# Altium schematic sheet Intercomm_sheet_1.SchDoc
size 594 x 420 mm; SheetNumber: 1; SheetTotal: 2
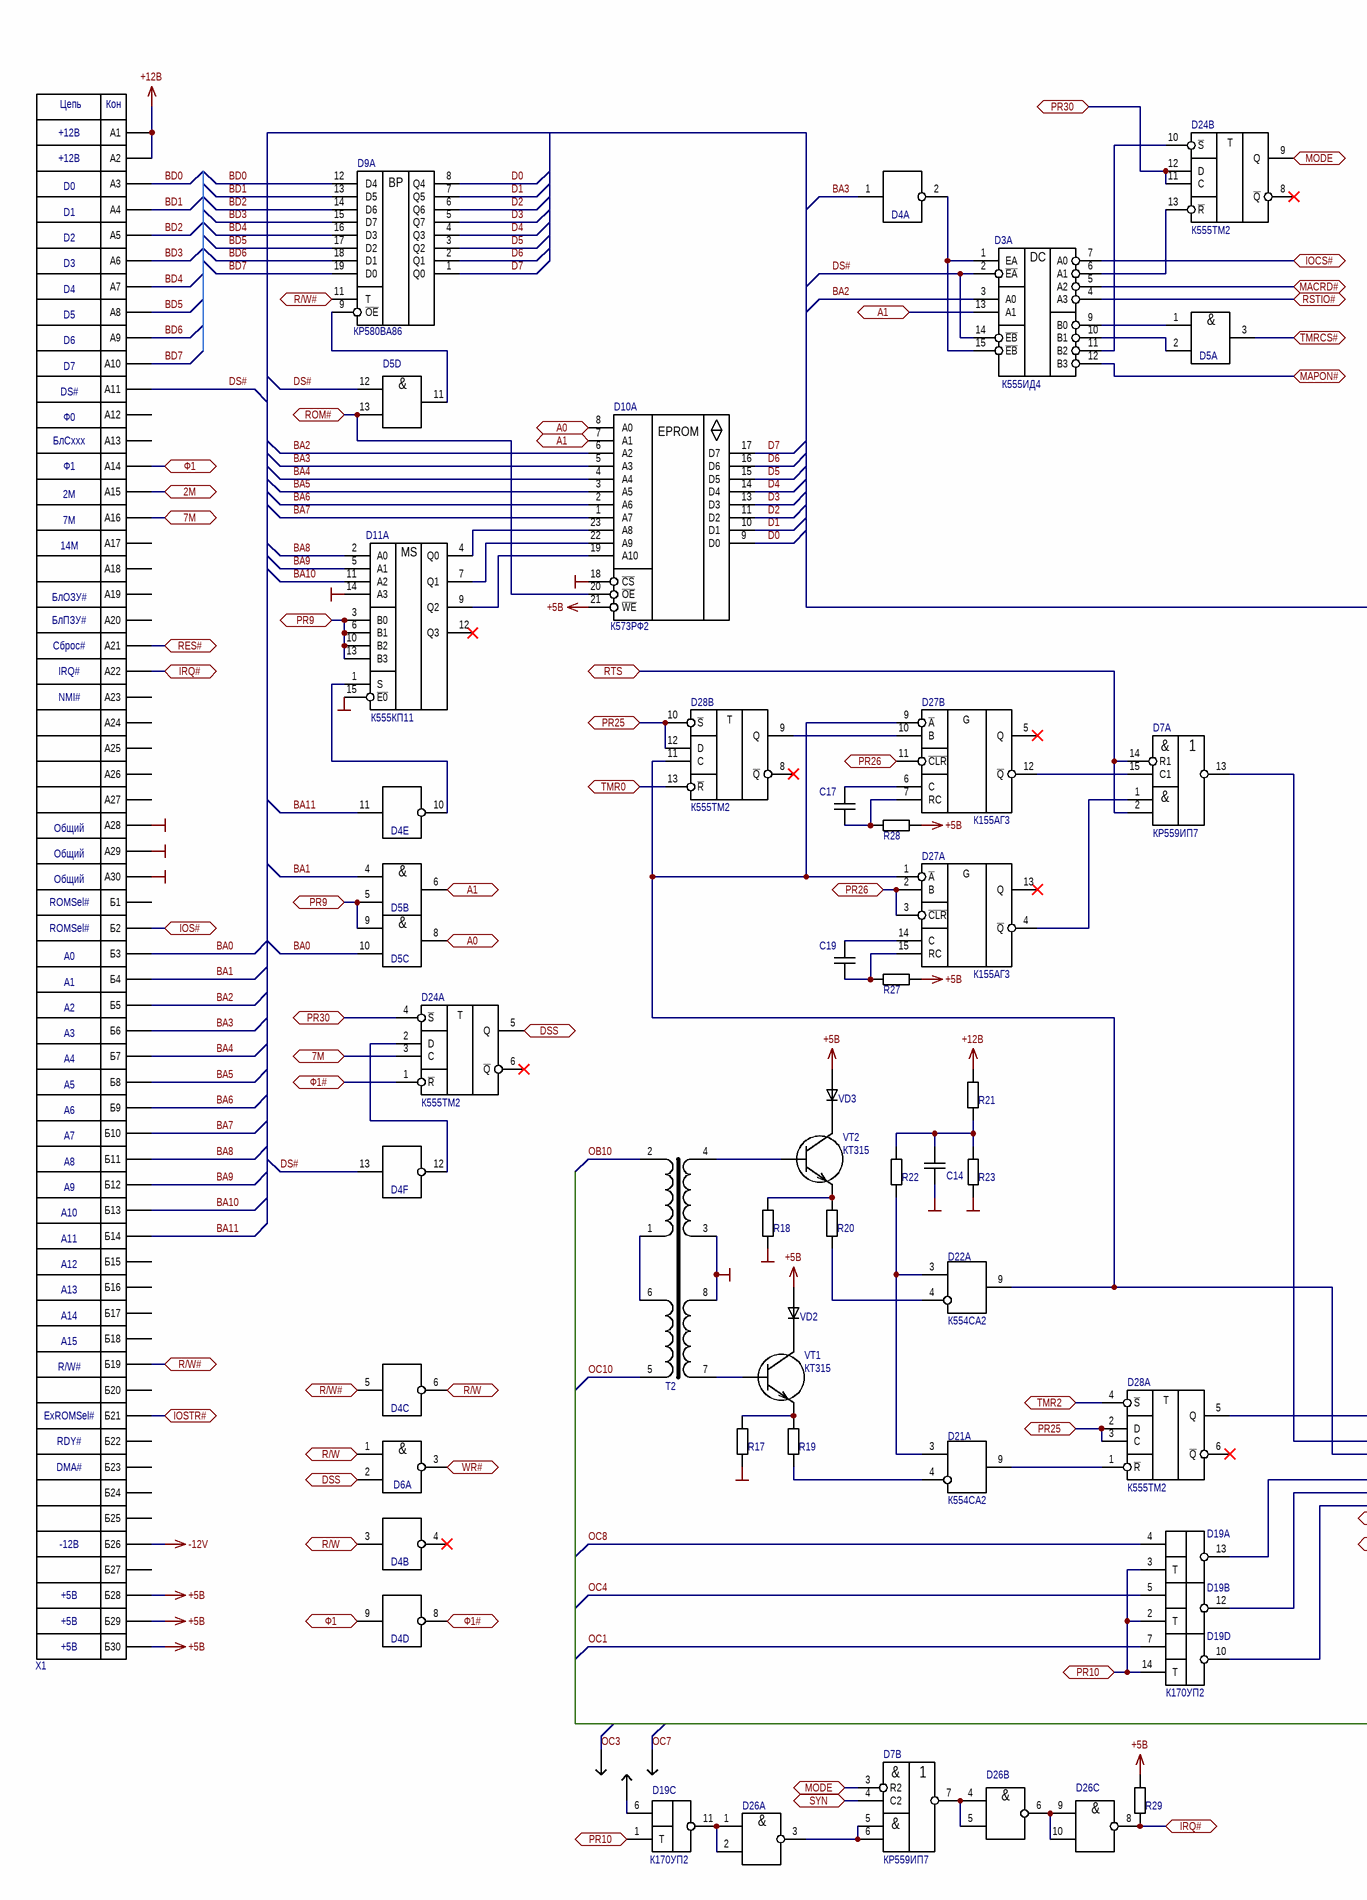
[diagram p0: Intercomm_sheet_1.SchDoc, left]
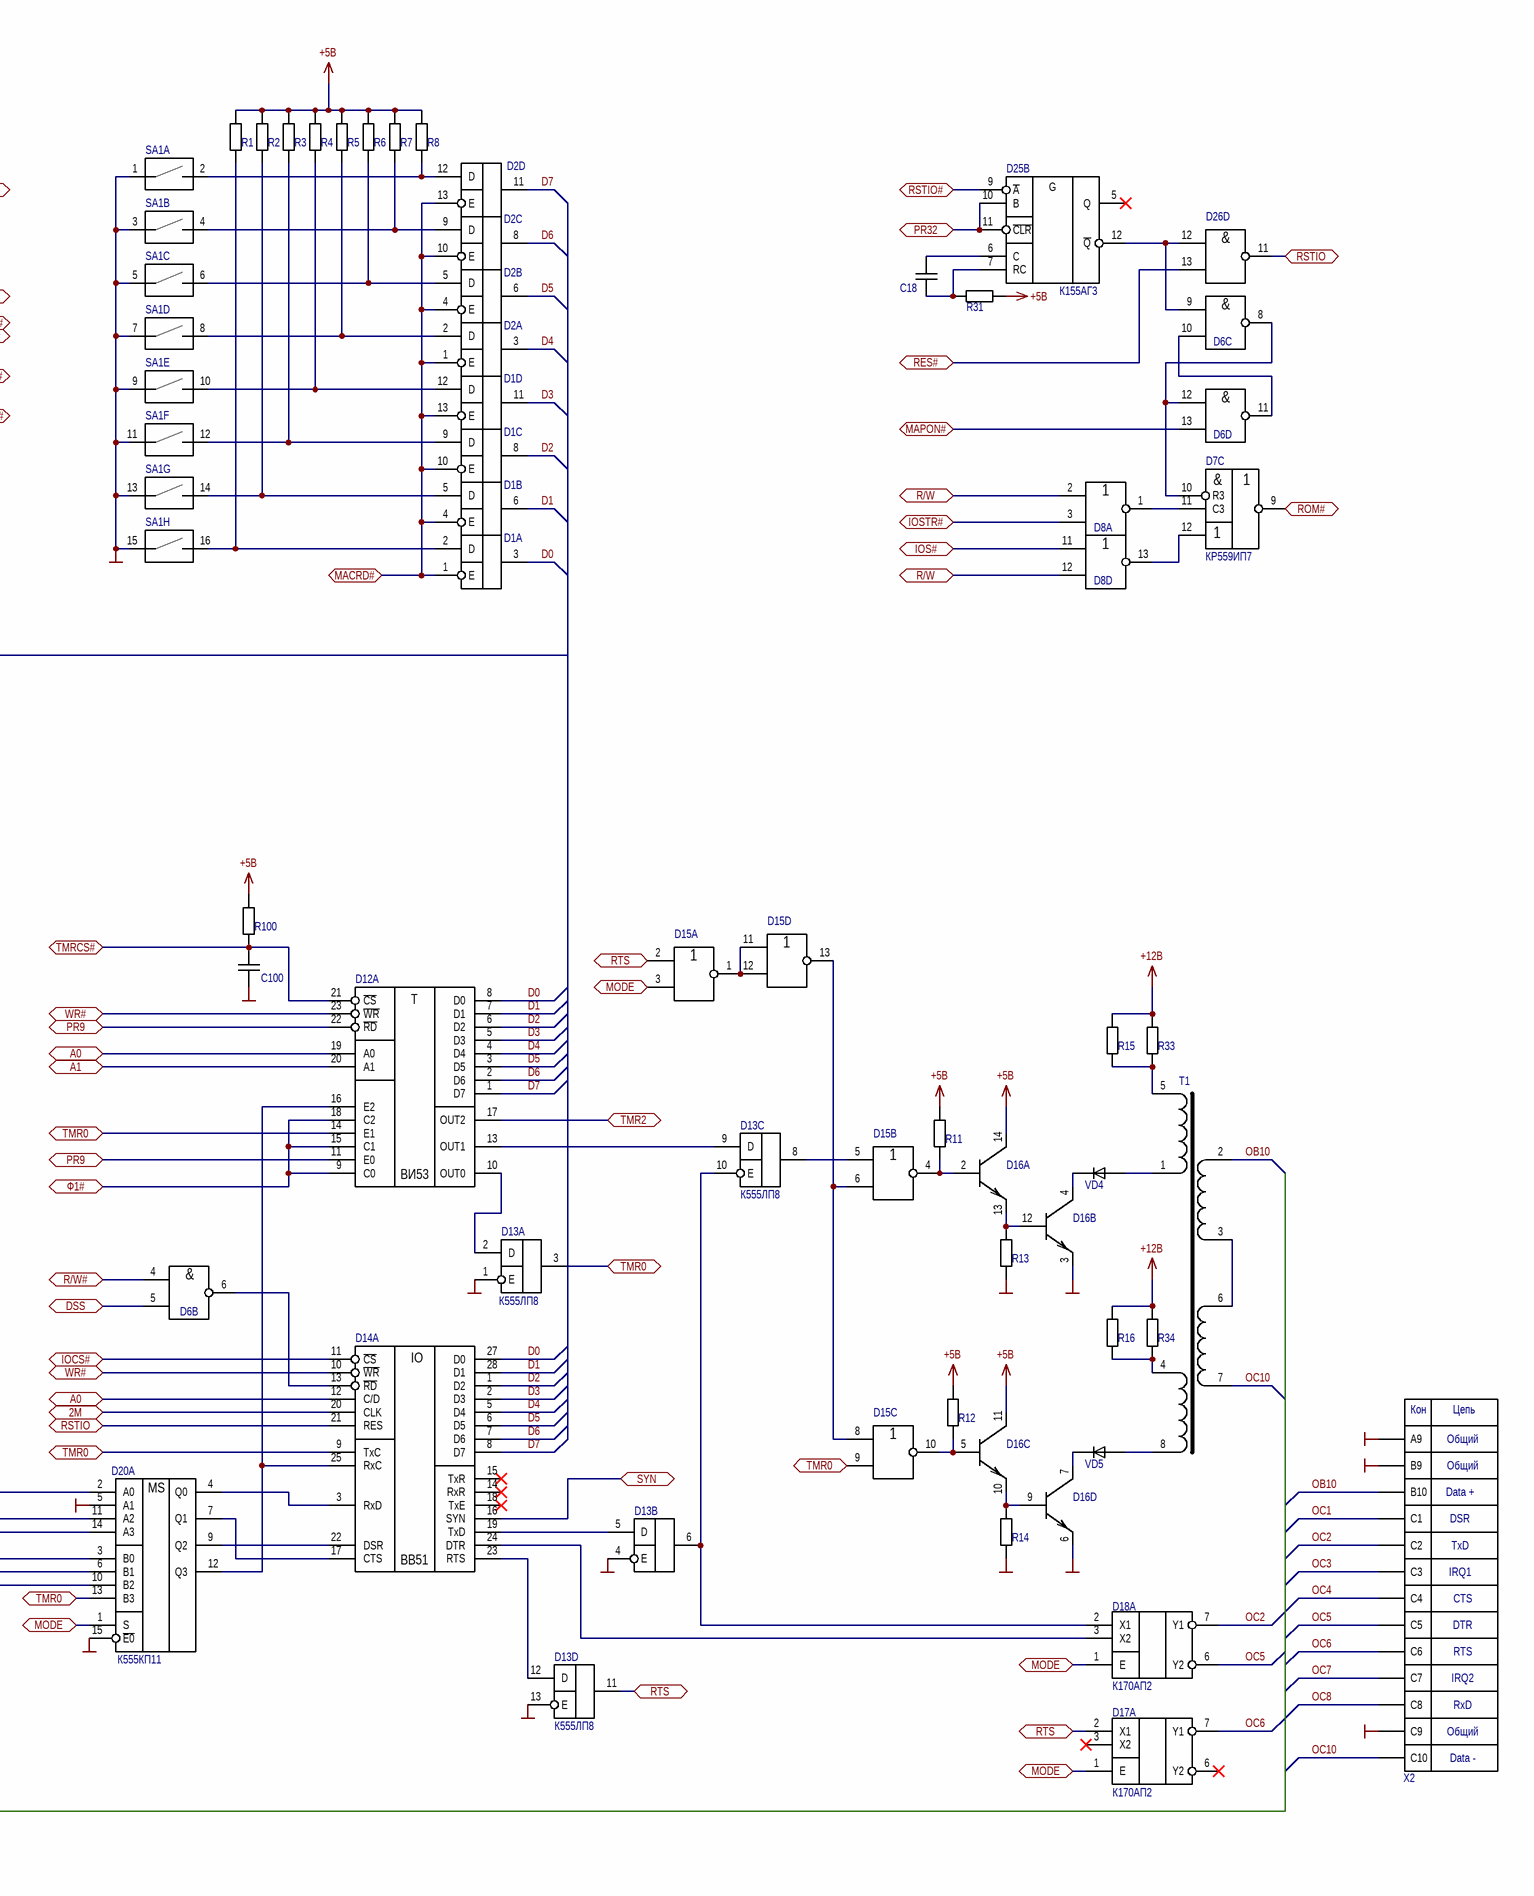
[diagram p1: Intercomm_sheet_1.SchDoc, right]

## Parts
C14  0,1  [C5]  (value not drawn)
C17  0,1  [C5]  (value not drawn)
C18  0,1  [C5]  (value not drawn)
C19  0,1  [C5]  (value not drawn)
C100  0,1  [C5]  (value not drawn)
D1  К555ЛП8  [201.14]  (value not drawn)  (parts A,B,C,D of 5)
D2  К555ЛП8  [201.14]  (value not drawn)  (parts A,B,C,D of 5)
D3  К555ИД4  [201.16]  (part A of 2)
D4  К555ТЛ2  [201.14]  (value not drawn)  (parts A,B,C,D,E,F of 7)
D5  К555ЛИ1  [201.14]  (value not drawn)  (parts A,B,C,D of 5)
D6  К555ЛА3  [201.14]  (value not drawn)  (parts A,B,C,D of 5)
D7  КР559ИП7  [201.16]  (parts A,B,C of 4)
D8  К555ЛЕ1  [201.14]  (value not drawn)  (parts A,D of 5)
D9  КР580ВА86  [2140.20]  (part A of 2)
D10  К573РФ2  [2120.24 socket]  (part A of 2)
D11  К555КП11  [201.16]  (part A of 2)
D12  КР580ВИ53  [2120.24]  (value not drawn)  (part A of 2)
D13  К555ЛП8  [201.14]  (parts A,B,C,D of 5)
D14  КР580ВВ51А  [2121.28]  (value not drawn)  (part A of 2)
D15  К555ЛЕ1  [201.14]  (value not drawn)  (parts A,B,C,D of 5)
D16  1НТ251  [SOP125P1150X265-14N]  (value not drawn)  (parts A,B,C,D of 4)
D17  К170АП2  [2101.8]  (part A of 2)
D18  К170АП2  [2101.8]  (part A of 2)
D19  К170УП2  [201.16]  (value not drawn)  (parts A,B,C,D of 5)
D20  К555КП11  [201.16]  (part A of 2)
D21  К554СА2  [201.14]  (part A of 2)
D22  К554СА2  [201.14]  (part A of 2)
D24  К555ТМ2  [201.14]  (parts A,B of 3)
D25  К155АГ3  [201.16]  (part B of 3)
D26  К555ЛА3  [201.14]  (value not drawn)  (parts A,B,C,D of 5)
D27  К155АГ3  [201.16]  (parts A,B of 3)
D28  К555ТМ2  [201.14]  (parts A,B of 3)
R1  1K  [R10]  (value not drawn)
R2  1K  [R10]  (value not drawn)
R3  1K  [R10]  (value not drawn)
R4  1K  [R10]  (value not drawn)
R5  1K  [R10]  (value not drawn)
R6  1K  [R10]  (value not drawn)
R7  1K  [R10]  (value not drawn)
R8  1K  [R10]  (value not drawn)
R11  1K  [R10]  (value not drawn)
R12  1K  [R10]  (value not drawn)
R13  1K  [R10]  (value not drawn)
R14  1K  [R10]  (value not drawn)
R15  1K  [R10]  (value not drawn)
R16  1K  [R10]  (value not drawn)
R17  1K  [R10]  (value not drawn)
R18  1K  [R10]  (value not drawn)
R19  1K  [R10]  (value not drawn)
R20  1K  [R10]  (value not drawn)
R21  1K  [R10]  (value not drawn)
R22  1K  [R10]  (value not drawn)
R23  1K  [R10]  (value not drawn)
R27  1K  [R10]  (value not drawn)
R28  1K  [R10]  (value not drawn)
R29  1K  [R10]  (value not drawn)
R31  1K  [R10]  (value not drawn)
R33  1K  [R10]  (value not drawn)
R34  1K  [R10]  (value not drawn)
R100  1K  [R10]  (value not drawn)
SA1  ВДМ1-8  [SW8]  (value not drawn)  (parts A,B,C,D,E,F,G,H of 8)
T1  COMM_T1  [COMM_T]  (value not drawn)
T2  COMM_T2  [COMM_T]  (value not drawn)
TP1  TEST_PAD  [TEST_PAD]  (value not drawn)
TP2  TEST_PAD  [TEST_PAD]  (value not drawn)
TP3  TEST_PAD  [TEST_PAD]  (value not drawn)
VD2  КД522Б  [DO-35-10mm]  (value not drawn)
VD3  КД522Б  [DO-35-10mm]  (value not drawn)
VD4  КД522Б  [DO-35-10mm]  (value not drawn)
VD5  КД522Б  [DO-35-10mm]  (value not drawn)
VT1  КТ315  [КТ315]
VT2  КТ315  [КТ315]
X1  Agat-Ext-Full  [AGAT_EXT]  (value not drawn)
X2  COMM_OUT_IO  [СНП34-300/27х9,4Р-22-Р]  (value not drawn)

## Ports
2M (bidir, see Intercomm_sheet_1[1B]), 2M (bidir, see Intercomm_sheet_1[3C]), 7M (bidir, see Intercomm_sheet_1[1B]), 7M (bidir, see Intercomm_sheet_1[1C]), A0 (bidir, see Intercomm_sheet_1[1A], Intercomm_sheet_1[1B], Intercomm_sheet_1[3B]), A0 (bidir, see Intercomm_sheet_1[1A], Intercomm_sheet_1[1B], Intercomm_sheet_1[3C]), A0 (bidir, see Intercomm_sheet_1[1A], Intercomm_sheet_1[3B], Intercomm_sheet_1[3C]), A0 (bidir, see Intercomm_sheet_1[1B], Intercomm_sheet_1[3B], Intercomm_sheet_1[3C]), A1 (bidir, see Intercomm_sheet_1[1A], Intercomm_sheet_1[1B], Intercomm_sheet_1[2A]), A1 (bidir, see Intercomm_sheet_1[1A], Intercomm_sheet_1[1B], Intercomm_sheet_1[3B]), A1 (bidir, see Intercomm_sheet_1[1A], Intercomm_sheet_1[2A], Intercomm_sheet_1[3B]), A1 (bidir, see Intercomm_sheet_1[1B], Intercomm_sheet_1[2A], Intercomm_sheet_1[3B]), DSS (bidir, see Intercomm_sheet_1[1C]), DSS (bidir, see Intercomm_sheet_1[1C], Intercomm_sheet_1[3C]), IOCS# (bidir, see Intercomm_sheet_1[2A]), IOCS# (bidir, see Intercomm_sheet_1[3C]), IOS# (bidir, see Intercomm_sheet_1[1B]), IOS# (bidir, see Intercomm_sheet_1[4B]), IOSTR# (bidir, see Intercomm_sheet_1[1C]), IOSTR# (bidir, see Intercomm_sheet_1[4B]), IRQ# (bidir, see Intercomm_sheet_1[1B]), IRQ# (bidir, see Intercomm_sheet_1[2D]), MACRD# (bidir, see Intercomm_sheet_1[2A]), MACRD# (bidir, see Intercomm_sheet_1[3B]), MAPON# (bidir, see Intercomm_sheet_1[2A]), MAPON# (bidir, see Intercomm_sheet_1[4A]), MODE (bidir, see Intercomm_sheet_1[2A], Intercomm_sheet_1[2D], Intercomm_sheet_1[3B], Intercomm_sheet_1[4D]), MODE (bidir, see Intercomm_sheet_1[2A], Intercomm_sheet_1[2D], Intercomm_sheet_1[4D]), MODE (bidir, see Intercomm_sheet_1[2D], Intercomm_sheet_1[3B], Intercomm_sheet_1[4D]), PR9 (bidir, see Intercomm_sheet_1[1B], Intercomm_sheet_1[3B], Intercomm_sheet_1[3C], Intercomm_sheet_3[1D]), PR9 (bidir, see Intercomm_sheet_1[1B], Intercomm_sheet_1[3B], Intercomm_sheet_3[1D]), PR9 (bidir, see Intercomm_sheet_1[1B], Intercomm_sheet_1[3C], Intercomm_sheet_3[1D]), PR10 (bidir, see Intercomm_sheet_1[1D], Intercomm_sheet_3[1D]), PR10 (bidir, see Intercomm_sheet_1[2D], Intercomm_sheet_3[1D]), PR25 (bidir, see Intercomm_sheet_1[1B], Intercomm_sheet_3[1E]), PR25 (bidir, see Intercomm_sheet_1[2C], Intercomm_sheet_3[1E]), PR26 (bidir, see Intercomm_sheet_1[2B], Intercomm_sheet_3[1E]), PR30 (bidir, see Intercomm_sheet_1[1C], Intercomm_sheet_3[1E]), PR30 (bidir, see Intercomm_sheet_1[2A], Intercomm_sheet_3[1E]), PR32 (bidir, see Intercomm_sheet_3[1E]), R/W (bidir, see Intercomm_sheet_1[1C], Intercomm_sheet_1[1D], Intercomm_sheet_1[4A]), R/W (bidir, see Intercomm_sheet_1[1C], Intercomm_sheet_1[1D], Intercomm_sheet_1[4A], Intercomm_sheet_1[4B]), R/W (bidir, see Intercomm_sheet_1[1C], Intercomm_sheet_1[1D], Intercomm_sheet_1[4B]), R/W (bidir, see Intercomm_sheet_1[1C], Intercomm_sheet_1[4A], Intercomm_sheet_1[4B]), R/W# (bidir, see Intercomm_sheet_1[1A], Intercomm_sheet_1[1C]), R/W# (bidir, see Intercomm_sheet_1[1A], Intercomm_sheet_1[1C], Intercomm_sheet_1[3C]), R/W# (bidir, see Intercomm_sheet_1[1C], Intercomm_sheet_1[3C]), RES# (bidir, see Intercomm_sheet_1[1B]), RES# (bidir, see Intercomm_sheet_1[4A]), ROM# (bidir, see Intercomm_sheet_1[1A]), ROM# (bidir, see Intercomm_sheet_1[4A]), RSTIO (bidir, see Intercomm_sheet_1[3C]), RSTIO (bidir, see Intercomm_sheet_1[4A]), RSTIO# (bidir, see Intercomm_sheet_1[2A]), RSTIO# (bidir, see Intercomm_sheet_1[4A]), RTS (bidir, see Intercomm_sheet_1[1B], Intercomm_sheet_1[3B], Intercomm_sheet_1[3D]), RTS (bidir, see Intercomm_sheet_1[1B], Intercomm_sheet_1[3B], Intercomm_sheet_1[4D]), RTS (bidir, see Intercomm_sheet_1[1B], Intercomm_sheet_1[3D], Intercomm_sheet_1[4D]), RTS (bidir, see Intercomm_sheet_1[3B], Intercomm_sheet_1[3D], Intercomm_sheet_1[4D]), SYN (bidir, see Intercomm_sheet_1[2D]), SYN (bidir, see Intercomm_sheet_1[3C]), TMR0 (bidir, see Intercomm_sheet_1[1B], Intercomm_sheet_1[2C], Intercomm_sheet_1[3C]), TMR0 (bidir, see Intercomm_sheet_1[1B], Intercomm_sheet_1[3C]), TMR0 (bidir, see Intercomm_sheet_1[2C], Intercomm_sheet_1[3C]), TMR2 (bidir, see Intercomm_sheet_1[2C]), TMR2 (bidir, see Intercomm_sheet_1[3C]), TMRCS# (bidir, see Intercomm_sheet_1[2A]), TMRCS# (bidir, see Intercomm_sheet_1[3B]), WR# (bidir, see Intercomm_sheet_1[1C], Intercomm_sheet_1[3B]), WR# (bidir, see Intercomm_sheet_1[1C], Intercomm_sheet_1[3C]), WR# (bidir, see Intercomm_sheet_1[3B], Intercomm_sheet_1[3C]), Ф1 (bidir, see Intercomm_sheet_1[1A]), Ф1 (bidir, see Intercomm_sheet_1[1D]), Ф1# (bidir, see Intercomm_sheet_1[1C], Intercomm_sheet_1[1D]), Ф1# (bidir, see Intercomm_sheet_1[1C], Intercomm_sheet_1[3C]), Ф1# (bidir, see Intercomm_sheet_1[1D], Intercomm_sheet_1[3C])

## Nets
+5В: D10.21(~{WE}) D16.11(C) D16.14(C) R1.1 R2.1 R3.1 R4.1 R5.1 R6.1 R7.1 R8.1 R11.2 R12.2 R27.2 R28.2 R29.2 R31.1 R100.2 VD2.1 VD3.1 X1.B28(Б28) X1.B29(Б29) X1.B30(Б30)
+12В: R15.1 R16.1 R21.2 R33.1 R34.1 X1.A1 X1.A2
-12V: X1.B26(Б26)
GND: C14.2 C100.2 D10.18(~{CS}) D11.14(A3) D11.15(~{E0}) D13.1(E) D13.4(E) D13.13(E) D16.3(E) D16.6(E) D20.5(A1) D20.15(~{E0}) R13.2 R14.2 R17.2 R18.2 R23.2 SA1.1 SA1.3 SA1.5 SA1.7 SA1.9 SA1.11 SA1.13 SA1.15 T2.3 T2.8 X1.A28 X1.A29 X1.A30 X2.A9 X2.B9 X2.C9
2M: D14.20(CLK) X1.A15 ; port 2M
7M: D24.3(C) X1.A16 ; port 7M
A0: D5.8(O) D10.8(A0) D12.19(A0) D14.12(C/D) ; port A0
A1: D3.13(A1) D5.6(O) D10.7(A1) D12.20(A1) ; port A1
BA0: D5.10(B) X1.B3(Б3)
BA1: D5.4(A) X1.B4(Б4)
BA2: D3.3(A0) D10.6(A2) X1.B5(Б5)
BA3: D4.1(A) D10.5(A3) X1.B6(Б6)
BA4: D10.4(A4) X1.B7(Б7)
BA5: D10.3(A5) X1.B8(Б8)
BA6: D10.2(A6) X1.B9(Б9)
BA7: D10.1(A7) X1.B10(Б10)
BA8: D11.2(A0) X1.B11(Б11)
BA9: D11.5(A1) X1.B12(Б12)
BA10: D11.11(A2) X1.B13(Б13)
BA11: D4.11(A) X1.B14(Б14)
BD0: D9.12(D4) X1.A3
BD1: D9.13(D5) X1.A4
BD2: D9.14(D6) X1.A5
BD3: D9.15(D7) X1.A6
BD4: D9.16(D3) X1.A7
BD5: D9.17(D2) X1.A8
BD6: D9.18(D1) X1.A9
BD7: D9.19(D0) X1.A10
D0: D1.3(O) D9.8(Q4) D10.9(D0) D12.8(D0) D14.27(D0)
D1: D1.6(O) D9.7(Q5) D10.10(D1) D12.7(D1) D14.28(D1)
D2: D1.8(O) D9.6(Q6) D10.11(D2) D12.6(D2) D14.1(D2)
D3: D1.11(O) D9.5(Q7) D10.13(D3) D12.5(D3) D14.2(D3)
D4: D2.3(O) D9.4(Q3) D10.14(D4) D12.4(D4) D14.5(D4)
D5: D2.6(O) D9.3(Q2) D10.15(D5) D12.3(D5) D14.6(D5)
D6: D2.8(O) D9.2(Q1) D10.16(D6) D12.2(D6) D14.7(D6)
D7: D2.11(O) D9.1(Q0) D10.17(D7) D12.1(D7) D14.8(D7)
DS#: D3.2(~{EA}) D3.14(~{EB}) D4.13(A) D5.12(A) X1.A11
DSS: D6.2(B) D6.5(B) D24.5(Q) ; port DSS
IOCS#: D3.7(A0) D14.11(~{CS}) ; port IOCS#
IOS#: D8.11(A) X1.B2(Б2) ; port IOS#
IOSTR#: D8.3(B) X1.B21(Б21) ; port IOSTR#
IRQ#: D26.8(~{O}) R29.1 X1.A22 ; port IRQ#
MACRD#: D1.1(E) D1.4(E) D1.10(E) D1.13(E) D2.1(E) D2.4(E) D2.10(E) D2.13(E) D3.5(A2) ; port MACRD#
MAPON#: D3.12(B3) D6.13(B) ; port MAPON#
MODE: D7.3(R2) D15.3(B) D17.1(E) D18.1(E) D20.1(S) D24.9(Q) ; port MODE
OB10: T1.2 T2.2 X2.B10
OC1: D19.7(IN) X2.C1
OC2: D18.7(Y1) X2.C2
OC3: TP3.1 X2.C3
OC4: D19.5(IN) X2.C4
OC5: D18.6(Y2) X2.C5
OC6: D17.7(Y1) X2.C6
OC7: TP1.1 X2.C7
OC8: D19.4(IN) X2.C8
OC10: T1.7 T2.5 X2.C10
PR9: D5.5(B) D5.9(A) D11.3(B0) D11.6(B1) D11.10(B2) D11.13(B3) D12.11(E0) D12.22(~{RD}) ; port PR9
PR10: D19.1(T) D19.2(T) D19.3(T) D19.14(T) ; port PR10
PR25: D28.2(D) D28.3(C) D28.10(~{S}) D28.12(D) ; port PR25
PR26: D27.2(B) D27.3(~{CLR}) D27.11(~{CLR}) ; port PR26
PR30: D24.4(~{S}) D24.11(C) D24.12(D) ; port PR30
PR32: D25.10(B) D25.11(~{CLR}) ; port PR32
R/W: D4.3(A) D4.6(~{O}) D6.1(A) D8.2(A) D8.12(B) ; port R/W
R/W#: D4.5(A) D6.4(A) D9.11(T) X1.B19(Б19) ; port R/W#
RES#: D26.13(B) X1.A21 ; port RES#
ROM#: D5.13(B) D7.9(~{O}) D10.20(~{OE}) ; port ROM#
RSTIO: D14.21(RES) D26.11(~{O}) ; port RSTIO
RSTIO#: D3.4(A3) D25.9(~{A}) ; port RSTIO#
RTS: D7.2(B) D7.14(R1) D13.11(O) D15.2(A) D17.2(X1) ; port RTS
SYN: D7.4(C2) D14.16(SYN) ; port SYN
TMR0: D12.14(E1) D13.3(O) D14.9(TxC) D15.9(B) D20.13(B3) D28.13(~{R}) ; port TMR0
TMR2: D12.17(OUT2) D28.4(~{S}) ; port TMR2
TMRCS#: C100.1 D5.3(O) D12.21(~{CS}) R100.1 ; port TMRCS#
WR#: D6.3(~{O}) D12.23(~{WR}) D14.10(~{WR}) ; port WR#
Ф1: D4.9(A) X1.A14 ; port Ф1
Ф1#: D4.8(~{O}) D12.9(C0) D12.15(C1) D12.18(C2) D24.1(~{R}) ; port Ф1#
NetC14_1: C14.1 R21.1 R22.1 R23.1
NetC17_1: C17.1 D27.6(C)
NetC17_2: C17.2 D27.7(RC) R28.1
NetC18_1: C18.1 D25.6(C)
NetC18_2: C18.2 D25.7(RC) R31.2
NetC19_1: C19.1 D27.14(C)
NetC19_2: C19.2 D27.15(RC) R27.1
NetD1_2: D1.2(D) R1.2 SA1.16
NetD1_5: D1.5(D) R2.2 SA1.14
NetD1_9: D1.9(D) R3.2 SA1.12
NetD1_12: D1.12(D) R4.2 SA1.10
NetD2_2: D2.2(D) R5.2 SA1.8
NetD2_5: D2.5(D) R6.2 SA1.6
NetD2_9: D2.9(D) R7.2 SA1.4
NetD2_12: D2.12(D) R8.2 SA1.2
NetD3_1: D3.1(EA) D3.15(~{EB}) D4.2(~{O})
NetD3_6: D3.6(A1) D24.13(~{R})
NetD3_9: D3.9(B0) D5.1(A)
NetD3_10: D3.10(B1) D5.2(B)
NetD3_11: D3.11(B2) D24.10(~{S})
NetD4_10: D4.10(~{O}) D11.1(S)
NetD4_12: D4.12(~{O}) D24.2(D)
NetD5_11: D5.11(O) D9.9(~{OE})
NetD6_6: D6.6(~{O}) D14.13(~{RD})
NetD6_8: D6.8(~{O}) D6.12(A) D7.10(R3)
NetD6_9: D6.9(A) D25.12(~{Q}) D26.12(A)
NetD6_10: D6.10(B) D6.11(~{O})
NetD7_1: D7.1(A) D27.4(~{Q})
NetD7_5: D7.5(A) D7.6(B) D26.3(~{O})
NetD7_7: D7.7(~{O}) D26.4(A) D26.5(B)
NetD7_11: D7.11(C3) D8.1(~{O})
NetD7_12: D7.12(A) D8.13(~{O})
NetD7_13: D7.13(~{O}) D20.11(A2)
NetD7_15: D7.15(C1) D27.12(~{Q})
NetD10_19: D10.19(A10) D11.9(Q2)
NetD10_22: D10.22(A9) D11.7(Q1)
NetD10_23: D10.23(A8) D11.4(Q0)
NetD12_10: D12.10(OUT0) D13.2(D)
NetD12_13: D12.13(OUT1) D13.9(D)
NetD12_16: D12.16(E2) D14.25(RxC) D20.12(Q3)
NetD13_5: D13.5(D) D14.19(TxD)
NetD13_6: D13.6(O) D13.10(E) D18.2(X1)
NetD13_8: D13.8(O) D15.5(A)
NetD13_12: D13.12(D) D14.23(RTS)
NetD14_3: D14.3(RxD) D20.4(Q0)
NetD14_17: D14.17(CTS) D20.7(Q1)
NetD14_22: D14.22(DSR) D20.9(Q2)
NetD14_24: D14.24(DTR) D18.3(X2)
NetD15_1: D15.1(~{O}) D15.11(A) D15.12(B)
NetD15_4: D15.4(~{O}) D16.2(B) R11.1
NetD15_6: D15.6(B) D15.8(A) D15.13(~{O})
NetD15_10: D15.10(~{O}) D16.5(B) R12.1
NetD16_4: D16.4(C) VD4.2
NetD16_7: D16.7(C) VD5.2
NetD16_9: D16.9(B) D16.10(E) R14.1
NetD16_12: D16.12(B) D16.13(E) R13.1
NetD19_6: D19.6(IN) TP2.1
NetD19_10: D19.10(OUT) D20.10(B2)
NetD19_11: D19.11(OUT) D26.1(A) D26.2(B)
NetD19_12: D19.12(OUT) D20.6(B1)
NetD19_13: D19.13(OUT) D20.3(B0)
NetD20_2: D20.2(A0) D28.5(Q)
NetD20_14: D20.14(A3) D22.9(OUT) D27.1(~{A}) D27.9(~{A}) D28.11(C)
NetD21_3: D21.3(IN) D22.3(IN) R22.2
NetD21_4: D21.4(~{IN}) R19.2
NetD21_9: D21.9(OUT) D28.1(~{R})
NetD22_4: D22.4(~{IN}) R20.2
NetD26_6: D26.6(~{O}) D26.9(A) D26.10(B)
NetD27_10: D27.10(B) D28.9(Q)
NetR15_2: R15.2 R33.2 T1.5
NetR16_2: R16.2 R34.2 T1.4
NetR17_1: R17.1 R19.1 VT1.E
NetR18_1: R18.1 R20.1 VT2.E
NetT1_1: T1.1 VD4.1
NetT1_3: T1.3 T1.6
NetT1_8: T1.8 VD5.1
NetT2_1: T2.1 T2.6
NetT2_4: T2.4 VT2.B
NetT2_7: T2.7 VT1.B
NetVD2_2: VD2.2 VT1.C
NetVD3_2: VD3.2 VT2.C

Not connected (* = marked no-connect by the designer): D4 4(~{O})*; D11 12(Q3)*; D14 14(RxR)* 15(TxR)* 18(TxE)*; D17 3(X2)* 6(Y2)*; D24 6(~{Q})* 8(~{Q})*; D25 5(Q)*; D27 5(Q)* 13(Q)*; D28 6(~{Q})* 8(~{Q})*; X1 A12 A13 A17 A18 A19 A20 A23 A24 A25 A26 A27 B1(Б1) B15(Б15) B16(Б16) B17(Б17) B18(Б18) B20(Б20) B22(Б22) B23(Б23) B24(Б24) B25(Б25) B27(Б27)

## Notes on the sheet
- Перв. примен.
- Справ. №
- Подп. и дата
- Инв. № дубл.
- Взам. инв. №
- Разраб.
- Изм.
- Лист
- № докум.
- Подп.
- Дата
- Лит.
- Масса
- Масштаб
- Пров.
- Т.контр.
- Листов
- Инв. № подл.
- Утв.
- Н.контр.
- 2.106-A2
- Копировал
- Формат А2
- (in symbol Agat-Ext-Full) Цепь; Кон; +12В; D0; D1; D2; D3; D4; D5; D6; D7; DS#; Ф0; БлCxxx; Ф1; 2М; 7М; 14М; БлОЗУ#; БлПЗУ#; Сброс#; IRQ#; NMI#; Общий; ROMSel#; A0; R/W#; ExROMSel#; RDY#; DMA#; -12В; +5В
- (in symbol COMM_OUT_IO) Кон; Цепь; Общий; Data +; DSR; TxD; IRQ1; CTS; DTR; RTS; IRQ2; RxD; Data -
- (in symbol К155АГ3, part A) G
- (in symbol К155АГ3, part B) G
- (in symbol К555ИД4, part A) DC
- (in symbol К555КП11, part A) MS
- (in symbol К555ЛА3, part A) &
- (in symbol К555ЛА3, part B) &
- (in symbol К555ЛА3, part C) &
- (in symbol К555ЛА3, part D) &
- (in symbol К555ЛИ1, part A) &
- (in symbol К555ЛИ1, part B) &
- (in symbol К555ЛИ1, part C) &
- (in symbol К555ЛИ1, part D) &
- (in symbol К555ТМ2, part A) T
- (in symbol К555ТМ2, part B) T
- (in symbol К573РФ2, part A) EPROM
- (in symbol КР559ИП7, part A) &
- (in symbol КР559ИП7, part B) &
- (in symbol КР559ИП7, part C) &
- (in symbol КР580ВА86_1, part A) BP
- (in symbol КР580ВВ51А, part A) IO; ВВ51
- (in symbol КР580ВИ53, part A) T; ВИ53

## Library data of the parts
C14 C17-C19 C100 = К10-17: Value: 0,1
D7 = КР559ИП7: ManufacturerPartNumber: К555ЛА3
D8 D15 = К555ЛЕ1: ManufacturerPartNumber: К555ЛА3
D9 = КР580ВА86_1
R1-R8 R11-R23 R27-R29 R31 R33 R34 R100 = С2-23: Резистор; Value: 1K
D3 = К555ИД4: ManufacturerPartNumber: К555ИД4
D5 = К555ЛИ1: ManufacturerPartNumber: К555ЛИ1
D6 D26 = К555ЛА3: ManufacturerPartNumber: К555ЛА3
D11 D20 = К555КП11: ManufacturerPartNumber: К555КП11